# Altium schematic sheet LIDO-HW.100.Page_8.SchDoc
size A3; SheetNumber: 12; SheetTotal: 14
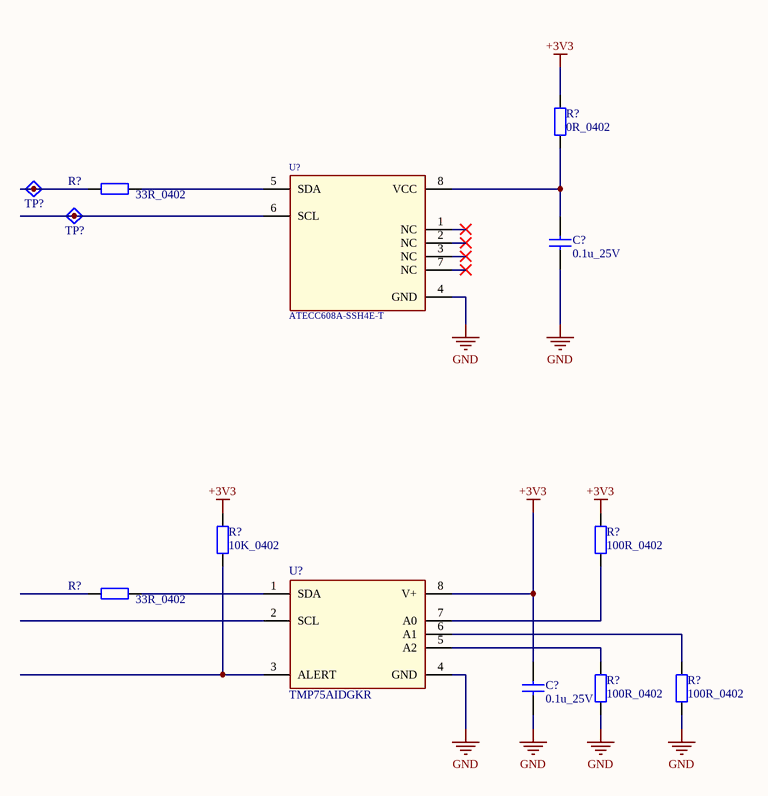
[diagram p0: LIDO-HW.100.Page_8.SchDoc]

## Parts
(Parts that share a designator on the sheet are numbered #1, #2 ... from top to bottom, then left to right.)
C?#1  0.1u_25V
C?#2  0.1u_25V
R?#1  0R_0402
R?#2  33R_0402
R?#3  10K_0402
R?#4  100R_0402
R?#5  33R_0402
R?#6  100R_0402
R?#7  100R_0402
TP?#1  TestPoint_A  (value not drawn)  (no BOM)
TP?#2  TestPoint_A  (value not drawn)  (no BOM)
U?#1  ATECC608A-SSH4E-T  [SOIC8P127_490X600X175L83X42N]
U?#2  TMP75AIDGKR  [SOP8P65_300X490X110L55X31N]

## Nets
+3V3: C?#2.1 R?#1.2 R?#3.1 R?#4.1 U?#2.8(V+)
GND: C?#1.2 C?#2.2 R?#6.2 R?#7.2 U?#1.4(GND) U?#2.4(GND)
NetC?#1_1: C?#1.1 R?#1.1 U?#1.8(VCC)
NetR?#2_1: R?#2.1 U?#1.5(SDA)
NetR?#2_2: R?#2.2 TP?#1.1(TP)
NetR?#3_2: R?#3.2 U?#2.3(ALERT)
NetR?#4_2: R?#4.2 U?#2.7(A0)
NetR?#5_1: R?#5.1 U?#2.1(SDA)
NetR?#6_1: R?#6.1 U?#2.5(A2)
NetR?#7_1: R?#7.1 U?#2.6(A1)
NetTP?#2_1: TP?#2.1(TP) U?#1.6(SCL)

Not connected (* = marked no-connect by the designer): R?#5 2; U?#1 1(NC)* 2(NC)* 3(NC)* 7(NC)*; U?#2 2(SCL)

## Notes on the sheet
- Title:
- Size:
- Date:
- A3
- Sheet       of
- Engineer:
- Version:
- Part Number:
- Revision:
- Rev. date:
- Project:
- File:

## Library data of the parts
C?#1 C?#2 = Ceramic: Ceramic CAP Symbol
R?#1-R?#7 = Resistor: Resistor Symbol
TP?#1 TP?#2 = TestPoint_A: Test Point Symbol verion A; 00_Name: TP_XXmm; 01_Diameter: 1mm; 02_Layer: *
U?#1 = ATECC608A-SSHDA_A: IC AUTHENTICATION CHIP 8SOIC, custom for Dott; Manufacturer: Microchip Technology; Designer: Dekimo; Ratings: RoHS; Reviewed: Dekimo_30-06-2020; Case/Package: 8-SOIC; ComponentType: IC; Design Date: N/A; Manufacturer Part Number: ATECC608A-SSH4E-T; Max Operating Temperature: 85°C; Min Operating Temperature: -40°C; Value: ATECC608A-SSH4E-T
U?#2 = TMP75AIDGKR_A: Temperature Sensor Digital, Local -40°C ~ 125°C 11 b 8-VSSOP; Manufacturer: Texas Instruments; Designer: Matt Drazenovich; Ratings: RoHS; Reviewed: Dekimo_07-07-2020; Case/Package: 8-VSSOP; ComponentType: IC; Manufacturer Part Number: TMP75AIDGKR; Max Operating Temperature: 127°C; Min Operating Temperature: -40°C; Value: TMP75AIDGKR; Design Date: 03-07-2020